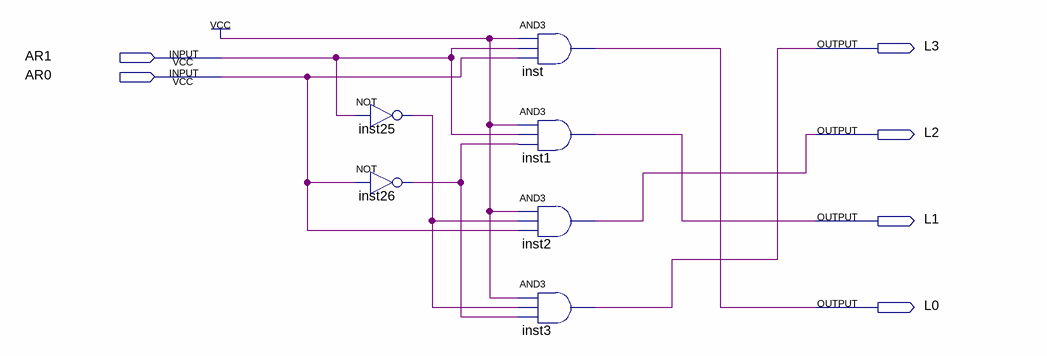
[diagram p0: schematic sheet]
// Quartus schematic 2_4WE.bdf as structural Verilog: 6 symbols, 6 pins
module \2_4WE  (
  input  AR1,
  input  AR0,
  output L3,
  output L2,
  output L1,
  output L0
);

  wire inst25_out, inst26_out;

  not inst25 (inst25_out, AR1);
  not inst26 (inst26_out, AR0);
  and inst (L0, 1'b1, AR1, AR0);
  and inst1 (L1, 1'b1, AR1, inst26_out);
  and inst2 (L2, 1'b1, inst25_out, AR0);
  and inst3 (L3, 1'b1, inst25_out, inst26_out);
endmodule
